# Altium project DRA818V Ham module.PrjPcb
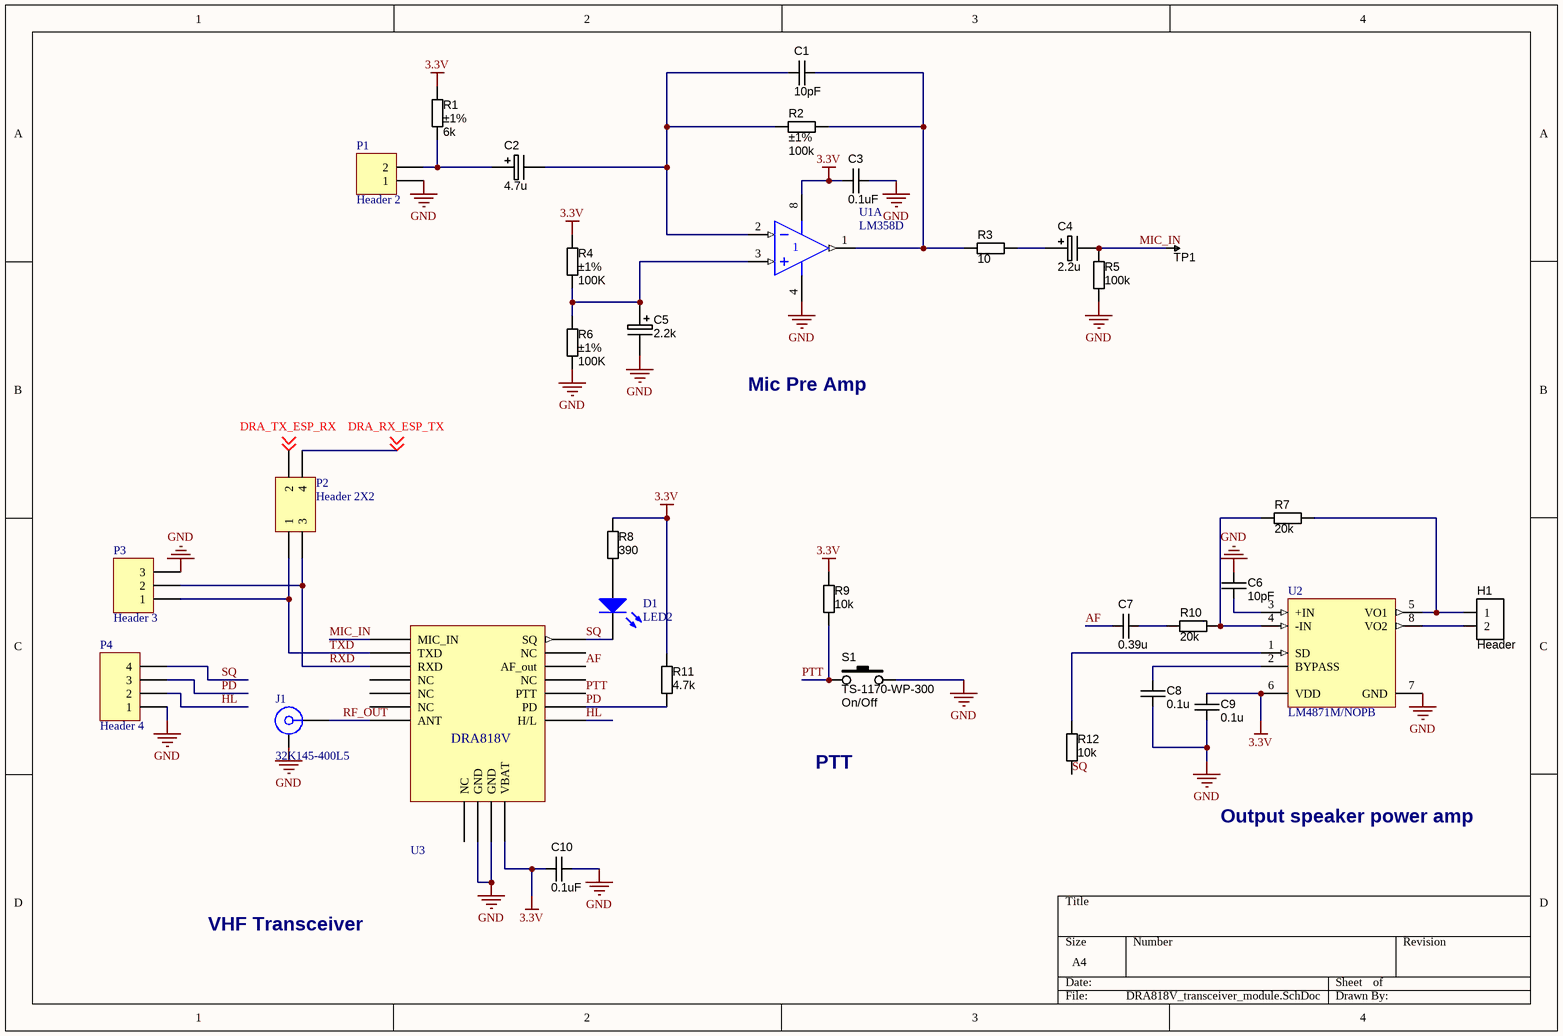
[diagram p0: DRA818V_transceiver_module.SchDoc]
2 sheets, 65 parts. Net scope: global (net labels, ports and power ports of the same name join across sheets).
Board files: DRA818V Ham module.PcbDoc, DRA818_Ham_module_2.PcbDoc
Sheets:
  DRA818V_transceiver_module.SchDoc
  ESP12_interface.SchDoc

## Sheet DRA818V_transceiver_module.SchDoc: DRA818V HAM transceiver
size A4; Date: 4/5/2016; DrawnBy: Salil Tembe; Engineer: Salil Tembe; DocumentNumber: 1; Revision: 1a; SheetNumber: 1; SheetTotal: 1; Reference: https://nebula.wsimg.com/bb20397fc7ffa1e43a58e57264597687?AccessKeyId=DAA432FA80C5DABC0234&disposition=0&alloworigin=1; DocumentName: DRA818V HAM transceiver

### Parts
C1  value 10pF  [CAPC2012X135N]  (hidden comment: approved sub OK)
C2  4.7u  [CAPMP3216X180N]
C3  value 0.1uF  [CAPC2012X135N]  (hidden comment: approved sub OK)
C4  2.2u  [CAPMP3216X180N]
C5  2.2k  [CAPMP3216X180N]
C6  value 10pF  [CAPC2012X135N]  (hidden comment: approved sub OK)
C7  value 0.39u  [CAPC2012X135N]  (hidden comment: approved sub OK)
C8  value 0.1u  [CAPC2012X135N]  (hidden comment: approved sub OK)
C9  value 0.1u  [CAPC2012X135N]  (hidden comment: approved sub OK)
C10  value 0.1uF  [CAPC2012X135N]  (hidden comment: approved sub OK)
D1  LED2  [3.2X1.6X1.1]
H1  Header  [HDR_1x2_Offset]  (no BOM)
J1  32K145-400L5  [ROS-32K145-400L5_V]
P1  Header 2  [HDR1X2]
P2  Header 2X2  [HDR2X2]
P3  Header 3  [HDR1X3]
P4  Header 4  [HDR1X4]
R1  value 6k  Tolerance: ±1%  [ERA-0805]  (hidden comment: Thick Film)
R2  value 100k  Tolerance: ±1%  [ERA-0805]  (hidden comment: Thick Film)
R3  value 10  [ERA-0805]  (hidden comment: Jumper)
R4  value 100K  Tolerance: ±1%  [ERA-0805]  (hidden comment: Thick Film)
R5  value 100k  [6-0805]  (hidden comment: Jumper)
R6  value 100K  Tolerance: ±1%  [ERA-0805]  (hidden comment: Thick Film)
R7  value 20k  [ERA-0805]  (hidden comment: Jumper)
R8  value 390  [ERA-0805]  (hidden comment: Jumper)
R9  value 10k  [ERA-0805]  (hidden comment: Jumper)
R10  value 20k  [ERA-0805]  (hidden comment: Jumper)
R11  value 4.7k  [ERA-0805]  (hidden comment: Jumper)
R12  value 10k  [ERA-0805]  (hidden comment: Jumper)
S1  Manufacturer Part Number 1: TS-1170-WP-300  Function: On/Off  [TACT-SWITCH-TS1170]  (hidden comment: SW_THT_PB_7.0mm)
TP1  TESTPOINT  [TP-R60]  (value not drawn)  (no BOM)
U1  LM358D  [751-02_N]  (part A of 2)
U2  LM4871M/NOPB  [M08A_N]
U3  DRA818V  [DRA818_breakout]  (value not drawn)

### Nets
3.3V: C3.1 C9.2 C10.1 R1.1 R4.1 R8.2 R9.1 R11.1 U1.8(V+) U2.6(VDD) U3.8(VBAT)
GND: C3.2 C5.2 C6.2 C8.1 C9.1 C10.2 J1.MP P1.1 P3.3 P4.1 R5.2 R6.2 S1.2 U1.4(V-) U2.7(GND) U3.9(GND) U3.10(GND)
AF: C7.1 U3.3(AF_out)
DRA_RX_ESP_TX: P2.4 ; off-sheet DRA_RX_ESP_TX
DRA_TX_ESP_RX: P2.2 ; off-sheet DRA_TX_ESP_RX
HL: P4.2 U3.7(H/L)
MIC_IN: C4.2 R5.1 TP1.1 U3.18(MIC_IN)
PD: P4.3 R11.2 U3.6(PD)
PTT: R9.2 S1.1 U3.5(PTT)
RF_OUT: J1.1 U3.12(ANT)
RXD: P2.3 P3.2 U3.16(RXD)
SQ: D1.2(K) P4.4 R12.2 U3.1(SQ)
TXD: P2.1 P3.1 U3.17(TXD)
NetC1_1: C1.1 C2.2 R2.1 U1.2(IN-)
NetC1_2: C1.2 R2.2 R3.1 U1.1(OUT)
NetC2_1: C2.1 P1.2 R1.2
NetC4_1: C4.1 R3.2
NetC5_1: C5.1 R4.2 R6.1 U1.3(IN+)
NetC6_1: C6.1 U2.3(+IN)
NetC7_2: C7.2 R10.1
NetC8_2: C8.2 U2.2(BYPASS)
NetD1_1: D1.1(A) R8.1
NetH1_1: H1.1 R7.2 U2.5(VO1)
NetH1_2: H1.2 U2.8(VO2)
NetR7_1: R7.1 R10.2 U2.4(-IN)
NetR12_1: R12.1 U2.1(SD)

Not connected (* = marked no-connect by the designer): U3 2(NC) 4(NC) 11(NC) 13(NC) 14(NC) 15(NC)

### Notes on the sheet
- Mic Pre Amp
- PTT
- Output speaker power amp
- VHF Transceiver

### Library data of the parts
C1 C3 C6-C10 = CAPC_100n_0805_X7R_100V_10%: Capacitor SMD Cer 100nF 10% 100V X7R 0805; Manufacturer 1: TDK Corporation; Manufacturer Part Number 1: C2012X7R2A104K; Ratings: 100V; X7R; Material: ceramic; SCDType: undef; Package / Case: 0805; Tolerance: ±10%; Supplier 1: Digi-Key; Supplier Part Number 1: 445-1418-1-ND
C2 C4 C5 = CAPT_33u_3216_6V3: Capacitor SMD Tantalum 33uF 10% 6.3V 3216-18; Manufacturer 1: Kemet; Manufacturer Part Number 1: T491A336K006AT; Material: Solid Tantalum; SCDType: source; Package / Case: EIA 535BAAC size A; Ratings: 6.3V; Tolerance: ±10%; ComponentLink2URL: http://www.avx.com/docs/Catalogs/tcj.pdf; ComponentLink2Description: http://www.avx.com/docs/Catalogs/tcj.pdf; Supplier 1: Digi-Key; Supplier Part Number 1: 399-9716-1-ND; ComponentLink1URL: http://capacitoredge.kemet.com/capedge2/DataSheet?pn=T491A336K006AT; ComponentLink1Description: http://capacitoredge.kemet.com/capedge2/DataSheet?pn=T491A336K006AT; Supplier 2: Digi-Key; Supplier Part Number 2: 478-1666-1-ND; Manufacturer 2: AVX Corporation; Manufacturer Part Number 2: TAJA336K006RNJ; Manufacturer 4: Samsung Electro-Mechanics; Manufacturer Part Number 4: TCSCS0J336KAAR; ComponentLink4URL: http://components.arrow.com/partservice/dataview/altium/51540102S9917798N4139?apiKey=aa438727d59eed98c4bed826d8d949c84cb5e685b92bf87346a0226bd2658797; ComponentLink4Description: http://components.arrow.com/partservice/dataview/altium/51540102S9917798N4139?apiKey=aa438727d59eed98c4bed826d8d949c84cb5e685b92bf87346a0226bd2658797; Supplier 3: Digi-Key; Supplier Part Number 3: 293D336X96R3A2TE3-ND; Manufacturer Part Number 3: 293D336X96R3A2TE3; Manufacturer 3: Vishay Sprague; ComponentLink3URL: http://www.vishay.com/doc?40002; ComponentLink3Description: http://www.vishay.com/doc?40002; Supplier 4: Arrow; Supplier Part Number 4: 51540102S9917798N4139
  C2: Value: 4.7u
  C4: Value: 2.2u
  C5: Value: 2.2k
D1 = LED2: Typical RED, GREEN, YELLOW, AMBER GaAs LED; Published: 8-Jun-2000; LatestRevisionDate: 17-Jul-2002; LatestRevisionNote: Re-released for DXP Platform.; PackageVersion: Feb-2002; PackageReference: 3.2X1.6X1.1; Publisher: Altium Limited; PackageDescription: SM LED; 2 Flat Leads
H1 = Header2P: Header, 2-pin
J1 = 32K145-400L5: SMA Right Angle Jack, Edge Mount, Up to 18 GHz, -55 to 155 degC; Design Note 1: Footprint in library is a generic example - only application specific footprint delivers High Performance; Desgin Note 2: For more information about DRC setting, please look at following webpage, http://techdocs.altium.com/display/SCRT/Design+Rule+for+Edge-Mount+Connectors; DatasheetVersion: b00; PackageVersion: b00; PackageReference: 32K145-400L5; PackageDescription: SMA Right Angle Jack, Edge Mount, 14.25 x 9.5 x 4.46 mm; Mounting Technology: Surface Mount; PartNumber: 32K145-400L5; ComponentLink1Description: Manufacturer URL; ComponentLink1URL: http://www.rosenberger.de; ComponentLink2Description: Datasheet; ComponentLink2URL: http://rosenberger.de/ok/images/documents/db/32K145-400L5.pdf; ComponentLink3Description: Package Specification; ComponentLink3URL: http://rosenberger.de/ok/images/documents/db/32K145-400L5.pdf; ComponentLink4Description: Series Overview / Design Note; ComponentLink4URL: http://rosenberger.de/ok/images/documents/spez/32.pdf; ComponentLink5Description: Webshop / RFQ; ComponentLink5URL: http://www.rosenberger.com/en/contact/sales/
P1 = Header 2: Header, 2-Pin; LatestRevisionDate: 17-Jul-2002; LatestRevisionNote: Re-released for DXP Platform.; Publisher: Altium Limited
P2 = Header 2X2: Header, 2-Pin, Dual row; LatestRevisionDate: 17-Jul-2002; LatestRevisionNote: Re-released for DXP Platform.; Publisher: Altium Limited
P3 = Header 3: Header, 3-Pin; LatestRevisionDate: 17-Jul-2002; LatestRevisionNote: Re-released for DXP Platform.; Publisher: Altium Limited
P4 = Header 4: Header, 4-Pin; LatestRevisionDate: 17-Jul-2002; LatestRevisionNote: Re-released for DXP Platform.; Publisher: Altium Limited
R1 = RES_1K3_0805_1%: Resistor SMD chip 1.3k Ohm 0.125W 1% 0805; Manufacturer 1: Vishay/Dale; Manufacturer Part Number 1: CRCW08051K30FKEA; Ratings: 1/8W; SCDType: spec; Package / Case: 0805 (2012 metric); Supplier 1: Digi-Key; Supplier Part Number 1: 541-1.30KCCT-ND
R2 = RES_7K87_0805_1%: Resistor SMD chip 7.87k Ohm 0.125W 1% 0805; Manufacturer 1: Vishay/Dale; Manufacturer Part Number 1: CRCW08057K87FKEA; Ratings: 1/8W; SCDType: spec; Package / Case: 0805 (2012 metric); Supplier 1: Digi-Key; Supplier Part Number 1: 541-7.87KCCT-ND
R3 R5 R7-R12 = RES_0R_0805: Resistor SMD chip 0.0 Ohm 0.125W 0805; Manufacturer 1: Samsung Electro-Mechanics America, Inc; Manufacturer Part Number 1: RC2012J000CS; Ratings: 1/8W; SCDType: spec; Tolerance: N/A; Package / Case: 0805 (2012 metric); Supplier 1: Digi-Key; Supplier Part Number 1: 1276-5466-6-ND; RoHS 1: RoHS Compliant; ComponentLink1URL: http://www.samsungsem.com/servlet/FileDownload?filename=productcatalog/pdf/Chip_Resistor.pdf; ComponentLink1Description: http://www.samsungsem.com/servlet/FileDownload?filename=productcatalog/pdf/Chip_Resistor.pdf; Supplier 2: Digi-Key; Supplier Part Number 2: RMCF0805ZT0R00DKR-ND; Manufacturer 2: Stackpole Electronics Inc; Manufacturer Part Number 2: RMCF0805ZT0R00; RoHS 2: RoHS Compliant; ComponentLink2URL: http://www.seielect.com/Catalog/SEI-RMCF_RMCP.pdf; ComponentLink2Description: http://www.seielect.com/Catalog/SEI-RMCF_RMCP.pdf; Supplier 3: Digi-Key; Supplier Part Number 3: 311-0.0ARDKR-ND; Manufacturer 3: Yageo; Manufacturer Part Number 3: RC0805JR-070RL; RoHS 3: RoHS Compliant; ComponentLink3URL: http://media.digikey.com/pdf/Data%20Sheets/Yageo%20PDFs/RC0805%20Pb%20Free.pdf; ComponentLink3Description: http://media.digikey.com/pdf/Data%20Sheets/Yageo%20PDFs/RC0805%20Pb%20Free.pdf; Supplier 4: Digi-Key; Supplier Part Number 4: P0.0ADKR-ND; Manufacturer 4: Panasonic Electronic Components; Manufacturer Part Number 4: ERJ-6GEY0R00V; RoHS 4: RoHS Compliant; ComponentLink4URL: http://industrial.panasonic.com/www-cgi/jvcr13pz.cgi?E+PZ+3+AOA0001+ERJ6GEY0R00V+7+WW; ComponentLink4Description: http://industrial.panasonic.com/www-cgi/jvcr13pz.cgi?E+PZ+3+AOA0001+ERJ6GEY0R00V+7+WW; Supplier 5: Digi-Key; Supplier Part Number 5: RHM0.0CPDKR-ND; Manufacturer 5: Rohm Semiconductor; Manufacturer Part Number 5: MCR10ERTJ000; RoHS 5: RoHS Compliant; ComponentLink5URL: http://rohmfs.rohm.com/en/products/databook/datasheet/passive/resistor/chip_resistor/mcr_g.pdf; ComponentLink5Description: http://rohmfs.rohm.com/en/products/databook/datasheet/passive/resistor/chip_resistor/mcr_g.pdf
R4 R6 = RES_100K_0805_1%: Resistor SMD chip 100k Ohm 0.125W 1% 0805; Manufacturer 1: Vishay/Dale; Manufacturer Part Number 1: CRCW0805100KFKEA; Ratings: 1/8W; SCDType: spec; Package / Case: 0805 (2012 metric); Supplier 1: Digi-Key; Supplier Part Number 1: 541-100KCCT-ND
S1 = SW_THT_PB_7.0mm: Switch, tact, 7.0mm stem; Manufacturer 1: Bond-Tact; SCDType: source*; Package / Case: 6.5x6.5mm; 7.0mm stem; Material: Brass/Nylon/Ag plating
TP1 = TESTPOINT: SMD test pin
U1 = LM358D: Dual Low-Power Operational Amplifier; Published: 17-Jul-2002; LatestRevisionDate: 13-Apr-2006; LatestRevisionNote: IPC-7351 Footprint Added.; DatasheetVersion: 1988; PackageReference: 751-02; Publisher: Altium Limited; PackageDescription: 8-Pin Small Outline Integrated Circuit 1.27 mm Pitch; Code_JEDEC: MS-012-AA; Code_IPC: SOIC127P600-8; ComponentLink1Description: Manufacturer Link; ComponentLink1URL: http://www.onsemi.com/site/products/parametrics/0,4446,251,00.html; ComponentLink2Description: Datasheet; ComponentLink2URL: http://www.onsemi.com/pub/Collateral/LM358-D.PDF
U2 = LM4871M/NOPB: 3W Audio Power Amplifier with Shutdown Mode, 8-pin Narrow SOIC, Pb-Free; Manufacturer: National Semiconductor; PackageTopMarking: NSZXTT*4871; PowerWise: N; CompType: Audio IC; Published: 1-Mar-2010; DatasheetVersion: Jan-2003; PackageVersion: revM, May-2009; PackageReference: M08A; Publisher: Altium Limited; PackageDescription: SOIC Narrow, 4.9 x 3.9 x 1.45mm, 8 Lead, 1.27mm Pitch; Supplier 1: Digi-Key; Supplier Part Number 1: LM4871M-ND; Supplier 2: Farnell; Supplier Part Number 2: 1468873; PartNumber: LM4871M/NOPB; RoHS: Y; PinCount: 8; Code_JEDEC: MS-012-AA; Code_IPC: SOIC127P600-8; ComponentLink1Description: LM4871 Datasheet; ComponentLink1URL: http://www.national.com/ds/LM/LM4871.pdf; ComponentLink2Description: LM4871 Web Page; ComponentLink2URL: http://www.national.com/pf/LM/LM4871.html; ComponentLink3Description: M08A Package Page; ComponentLink3URL: http://www.national.com/packaging/folders/m08a.html

## Sheet ESP12_interface.SchDoc
size A4
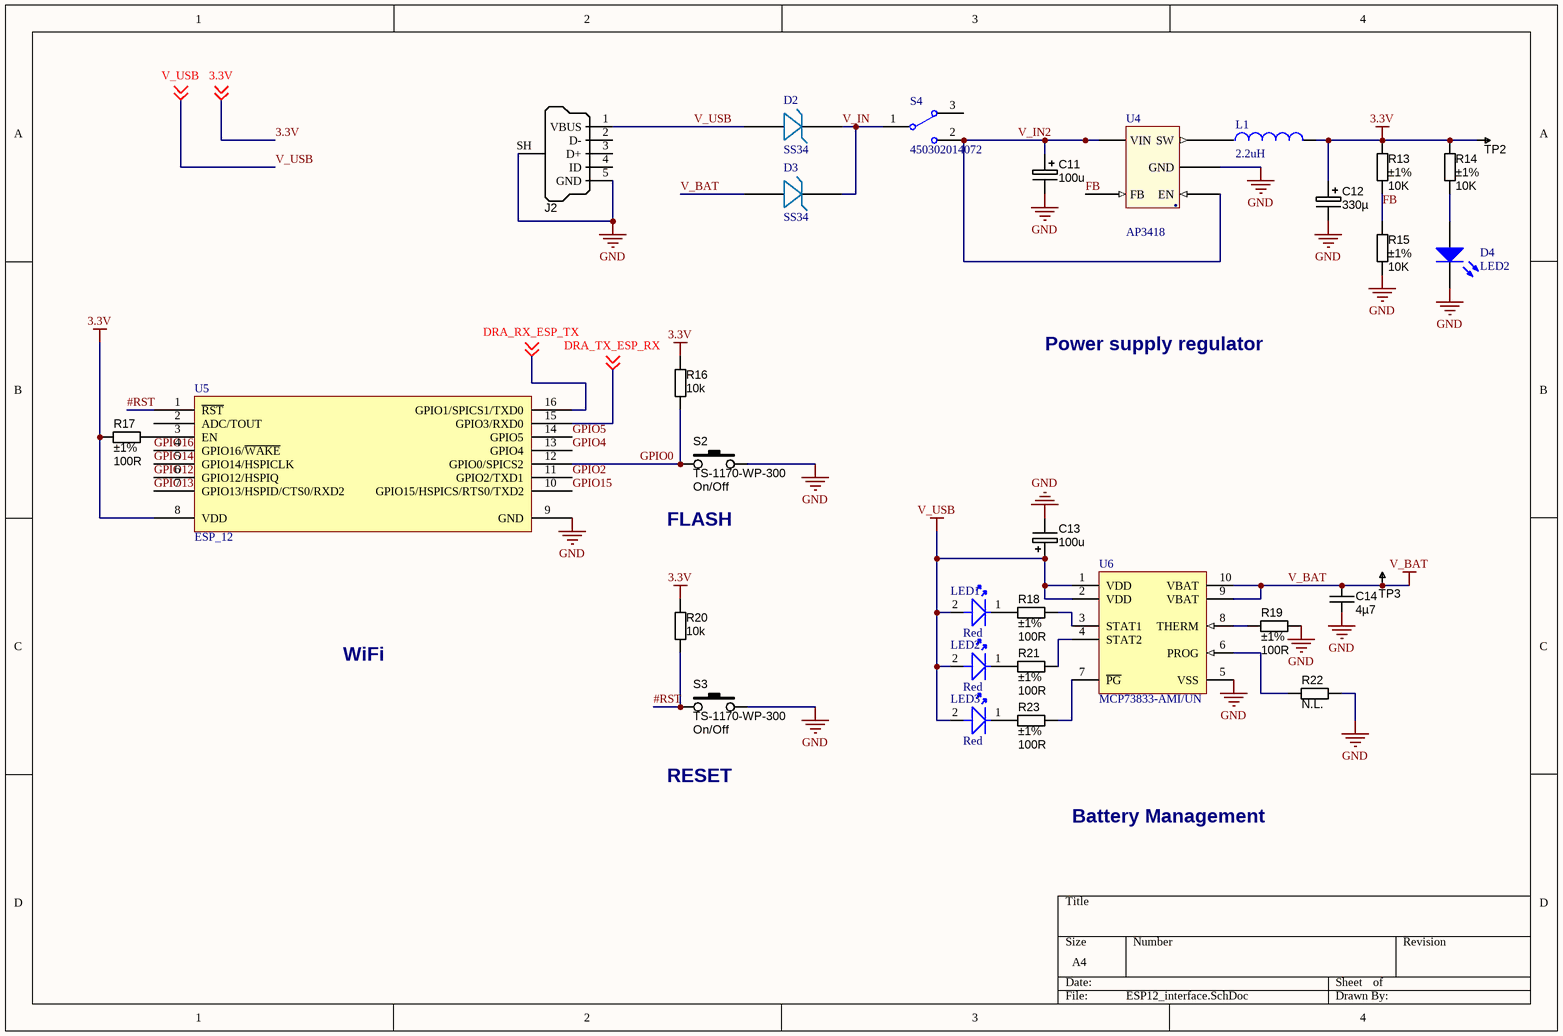
[diagram p1: ESP12_interface.SchDoc]

### Parts
C11  100u  [CAPMP7343X310N]
C12  330µ  [CAPMP7343X310N]
C13  100u  [CAPMP7343X310N]
C14  value 4µ7  [CAPC2012X135N]  (hidden comment: approved sub OK)
D2  SS34  [DO-214AB]
D3  SS34  [DO-214AB]
D4  LED2  [3.2X1.6X1.1]
J2  USB Micro Type B (recommended if hand soldering)  [USB_Micro-B_FCI_SMD]  (value not drawn)
L1  value 2.2uH  [Inductor 6.8uH Shielded]  (hidden comment: SRN6045)
LED1  Red  [Type 3mm]
LED2  Red  [Type 3mm]
LED3  Red  [Type 3mm]
R13  value 10K  Tolerance: ±1%  [RESC2012X70N]  (hidden comment: Thick Film)
R14  value 10K  Tolerance: ±1%  [RESC2012X70N]  (hidden comment: Thick Film)
R15  value 10K  Tolerance: ±1%  [RESC2012X70N]  (hidden comment: Thick Film)
R16  value 10k  [ERA-0805]  (hidden comment: Jumper)
R17  value 100R  Tolerance: ±1%  [RESC2012X70N]  (hidden comment: Thick Film)
R18  value 100R  Tolerance: ±1%  [RESC2012X70N]  (hidden comment: Thick Film)
R19  value 100R  Tolerance: ±1%  [RESC2012X70N]  (hidden comment: Thick Film)
R20  value 10k  [ERA-0805]  (hidden comment: Jumper)
R21  value 100R  Tolerance: ±1%  [RESC2012X70N]  (hidden comment: Thick Film)
R22  value N.L.  [RESC2012X70N]  (hidden comment: RES_NL_0805)  (no BOM)
R23  value 100R  Tolerance: ±1%  [RESC2012X70N]  (hidden comment: Thick Film)
S2  Manufacturer Part Number 1: TS-1170-WP-300  Function: On/Off  [TACT-SWITCH-TS1170]  (hidden comment: SW_THT_PB_7.0mm)
S3  Manufacturer Part Number 1: TS-1170-WP-300  Function: On/Off  [TACT-SWITCH-TS1170]  (hidden comment: SW_THT_PB_7.0mm)
S4  450302014072  [450302014072]
TP2  TESTPOINT  [TP-R60]  (value not drawn)  (no BOM)
TP3  TESTPOINT  [TP-R60]  (value not drawn)  (no BOM)
U4  AP3418  [SOT23-5]
U5  ESP_12  [ESP_12]
U6  MCP73833-AMI/UN  [MSOP-UN10_N]

### Nets
3.3V: C12.1 L1.2 R13.1 R14.1 R16.1 R17.1 R20.1 TP2.1 U5.8(VDD) ; off-sheet 3.3V
GND: C11.2 C12.2 C13.2 C14.2 D4.2(K) J2.5(GND) J2.SH(Shell) R15.2 R19.2 R22.2 S2.2 S3.2 U4.2(GND) U5.9(GND) U6.5(VSS)
V_BAT: C14.1 D3.A TP3.1 U6.9(VBAT) U6.10(VBAT)
V_USB: C13.1 D2.A J2.1(VBUS) LED1.2(A) LED2.2(A) LED3.2(A) U6.1(VDD) U6.2(VDD) ; off-sheet V_USB
#RST: R20.2 S3.1 U5.1(~{RST})
DRA_RX_ESP_TX: U5.16(GPIO1/SPICS1/TXD0) ; off-sheet DRA_RX_ESP_TX
DRA_TX_ESP_RX: U5.15(GPIO3/RXD0) ; off-sheet DRA_TX_ESP_RX
FB: R13.2 R15.1 U4.5(FB)
GPIO0: R16.2 S2.1 U5.12(GPIO0/SPICS2)
GPIO2: U5.11(GPIO2/TXD1)
GPIO4: U5.13(GPIO4)
GPIO5: U5.14(GPIO5)
GPIO12: U5.6(GPIO12/HSPIQ)
GPIO13: U5.7(GPIO13/HSPID/CTS0/RXD2)
GPIO14: U5.5(GPIO14/HSPICLK)
GPIO15: U5.10(GPIO15/HSPICS/RTS0/TXD2)
GPIO16: U5.4(GPIO16/~{WAKE})
V_IN: D2.K D3.K S4.1
V_IN2: C11.1 S4.2 U4.1(EN) U4.4(VIN)
NetD4_1: D4.1(A) R14.2
NetL1_1: L1.1 U4.3(SW)
NetLED1_1: LED1.1(K) R18.1
NetLED2_1: LED2.1(K) R21.1
NetLED3_1: LED3.1(K) R23.1
NetR17_2: R17.2 U5.3(EN)
NetR18_2: R18.2 U6.3(STAT1)
NetR19_1: R19.1 U6.8(THERM)
NetR21_2: R21.2 U6.4(STAT2)
NetR22_1: R22.1 U6.6(PROG)
NetR23_2: R23.2 U6.7(~{PG})

Not connected (* = marked no-connect by the designer): J2 2(D-) 3(D+) 4(ID); S4 3; U5 2(ADC/TOUT)

### Notes on the sheet
- Power supply regulator
- (near S2) FLASH
- WiFi
- RESET
- Battery Management
- (in symbol AP3418) .

### Library data of the parts
C11-C13 = CAPT_330u_2917_6V3: Capacitor SMD Tant 330uF 20% 6V3 2917; Manufacturer Size Code: D; Manufacturer Part Number: T520D337M006ATE015; Ratings: 6.3V; Material: Solid Tantalum; ESR (Equivalent Series Resistance): 15 mOhm; SCDType: spec; Package / Case: 2917 (7343 Metric); Tolerance: ±20%; Operating Temperature: -55°C ~ 125°C; Size / Dimension: 0.287" L x 0.169" W (7.30mm x 4.30mm); Height - Seated (Max): 0.122" (3.10mm); Supplier 1: Digi-Key; Supplier Part Number 1: 399-4052-1-ND; ComponentLink1URL: http://www.kemet.com/datasheets&T520D337M006ATE015; ComponentLink1Description: T520D Datasheet
  C11 C13: Value: 100u
  C12: Value: 330µ
C14 = CAPC_4u7_0805: Capacitor SMD Cer 4.7uF 10% 16V X5R 0805; Manufacturer 1: Taiyo Yuden; Manufacturer Part Number 1: EMK212BJ475KG-T; Ratings: 16V; X5R; Material: ceramic; SCDType: spec; Package / Case: 0805 (2012 Metric); Tolerance: ±10%; Supplier 1: Digi-Key; Supplier Part Number 1: 587-1294-1-ND; Operating Temperature: -55°C ~ 85°C; Size / Dimension: 0.079" L x 0.049" W (2.00mm x 1.25mm); Thickness (Max): 0.053" (1.35mm); ComponentLink1URL: http://www.yuden.co.jp/productdata/catalog/en/mlcc01_e.pdf; ComponentLink1Description: http://www.yuden.co.jp/productdata/catalog/en/mlcc01_e.pdf; Supplier 2: Digi-Key; Supplier Part Number 2: 1276-1065-1-ND; Manufacturer 2: Samsung Electro-Mechanics America, Inc; Manufacturer Part Number 2: CL21A475KOFNNNE; RoHS 2: RoHS Compliant; ComponentLink2URL: http://www.samsungsem.com/servlet/FileDownload?type=spec&file=CL21A475KOFNNNE.pdf; ComponentLink2Description: http://www.samsungsem.com/servlet/FileDownload?type=spec&file=CL21A475KOFNNNE.pdf; Supplier 3: Digi-Key; Supplier Part Number 3: 399-8101-1-ND; Manufacturer 3: Kemet; Manufacturer Part Number 3: C0805C475K4PACTU; RoHS 3: RoHS Compliant; ComponentLink3URL: http://capacitoredge.kemet.com/capedge2/DataSheet?pn=C0805C475K4PACTU; ComponentLink3Description: http://capacitoredge.kemet.com/capedge2/DataSheet?pn=C0805C475K4PACTU; Supplier 4: Digi-Key; Supplier Part Number 4: 490-7215-1-ND; Manufacturer 4: Murata Electronics North America; Manufacturer Part Number 4: GRM21BR61C475MA88L; RoHS 4: RoHS Compliant; ComponentLink4URL: http://psearch.murata.com/capacitor/product/GRM21BR61C475MA88#.pdf; ComponentLink4Description: http://psearch.murata.com/capacitor/product/GRM21BR61C475MA88#.pdf; Supplier 5: Digi-Key; Supplier Part Number 5: 445-7640-1-ND; Manufacturer 5: TDK Corporation; Manufacturer Part Number 5: C2012X5R1C475K125AC; RoHS 5: RoHS Compliant; ComponentLink5URL: http://product.tdk.com/capacitor/mlcc/en/documents/mlcc_commercial_general_en.pdf; ComponentLink5Description: http://product.tdk.com/capacitor/mlcc/en/documents/mlcc_commercial_general_en.pdf; RoHS 1: RoHS Compliant
D2 D3 = SS34 Schotkey Diode
D4 = LED2: as D1 on sheet DRA818V_transceiver_module; Published: 8-Jun-2000; LatestRevisionDate: 17-Jul-2002; LatestRevisionNote: Re-released for DXP Platform.; PackageVersion: Feb-2002; PackageReference: 3.2X1.6X1.1; Publisher: Altium Limited; PackageDescription: SM LED; 2 Flat Leads
J2 = USB_Micro_TypeB_FCI: Connector SMD-THD USB Micro Type B middle mount; Manufacturer 1: FCI; Manufacturer Part Number 1: 10103593-0001LF; SCDType: undef; Package / Case: SMD/THD mid-mount; Supplier 1: Digi-Key; Supplier Part Number 1: 609-4049-1-ND
L1 = Bourns Shielded inductor: SRN6045 shielded inductor
LED1-LED3 = WL-TMRW, Type 3mm, 151031YS06000: THT LED round mono-color color lens, WL-TMRW, Yellow; Manufacturer: Würth Elektronik eiSos GmbH; PartNo: 151031YS06000; ComponentLink1Description: Manufacturer; ComponentLink1URL: http://www.we-online.de; Created by: Christin Otto; Created Date: Oct-2014; ComponentLink2Description: Datasheet; ComponentLink2URL: http://katalog.we-online.de/pbs/datasheet/7448042001.pdfhttp://katalog.we-online.de/pbs/datasheet/7448042001.pdfhttp://katalog.we-online.de/pbs/datasheet/7448042001.pdfhttp://katalog.we-online.de/pbs/datasheet/151031YS06000.pdf; Emitting color: Yellow
R13-R15 = RES_10K_0805_1%: Resistor SMD chip 10k Ohm 0.125W 1% 0805; Manufacturer 1: Vishay/Dale; Manufacturer Part Number 1: CRCW080510K0FKEA; Ratings: 1/8W; SCDType: spec; Package / Case: 0805 (2012 metric); Supplier 1: Digi-Key; Supplier Part Number 1: 541-10.0KCCT-ND; Material: Thick Film
R16 R20 = RES_0R_0805: as R3 on sheet DRA818V_transceiver_module; Tolerance: N/A; Package / Case: 0805 (2012 metric); Supplier 1: Digi-Key; Supplier Part Number 1: 1276-5466-6-ND; RoHS 1: RoHS Compliant; ComponentLink1URL: http://www.samsungsem.com/servlet/FileDownload?filename=productcatalog/pdf/Chip_Resistor.pdf; ComponentLink1Description: http://www.samsungsem.com/servlet/FileDownload?filename=productcatalog/pdf/Chip_Resistor.pdf; Supplier 2: Digi-Key; Supplier Part Number 2: RMCF0805ZT0R00DKR-ND; Manufacturer 2: Stackpole Electronics Inc; Manufacturer Part Number 2: RMCF0805ZT0R00; RoHS 2: RoHS Compliant; ComponentLink2URL: http://www.seielect.com/Catalog/SEI-RMCF_RMCP.pdf; ComponentLink2Description: http://www.seielect.com/Catalog/SEI-RMCF_RMCP.pdf; Supplier 3: Digi-Key; Supplier Part Number 3: 311-0.0ARDKR-ND; Manufacturer 3: Yageo; Manufacturer Part Number 3: RC0805JR-070RL; RoHS 3: RoHS Compliant; ComponentLink3URL: http://media.digikey.com/pdf/Data%20Sheets/Yageo%20PDFs/RC0805%20Pb%20Free.pdf; ComponentLink3Description: http://media.digikey.com/pdf/Data%20Sheets/Yageo%20PDFs/RC0805%20Pb%20Free.pdf; Supplier 4: Digi-Key; Supplier Part Number 4: P0.0ADKR-ND; Manufacturer 4: Panasonic Electronic Components; Manufacturer Part Number 4: ERJ-6GEY0R00V; RoHS 4: RoHS Compliant; ComponentLink4URL: http://industrial.panasonic.com/www-cgi/jvcr13pz.cgi?E+PZ+3+AOA0001+ERJ6GEY0R00V+7+WW; ComponentLink4Description: http://industrial.panasonic.com/www-cgi/jvcr13pz.cgi?E+PZ+3+AOA0001+ERJ6GEY0R00V+7+WW; Supplier 5: Digi-Key; Supplier Part Number 5: RHM0.0CPDKR-ND; Manufacturer 5: Rohm Semiconductor; Manufacturer Part Number 5: MCR10ERTJ000; RoHS 5: RoHS Compliant; ComponentLink5URL: http://rohmfs.rohm.com/en/products/databook/datasheet/passive/resistor/chip_resistor/mcr_g.pdf; ComponentLink5Description: http://rohmfs.rohm.com/en/products/databook/datasheet/passive/resistor/chip_resistor/mcr_g.pdf
R17-R19 R21 R23 = RES_100R_0805_1%: Resistor SMD chip 100 Ohm 0.125W 1% 0805; Manufacturer 1: Yageo; Manufacturer Part Number 1: RC0805FR-07100RL; Ratings: 1/8 W; SCDType: spec; Package / Case: 0805 (2012 Metric); Material: Thick Film; Supplier 1: Digi-Key; Supplier Part Number 1: 311-100CRCT-ND
R22 = RES_NL_0805: Resistor, SMD chip; Package / Case: 0805 (2012 metric)
S2 S3 = SW_THT_PB_7.0mm: as S1 on sheet DRA818V_transceiver_module; Package / Case: 6.5x6.5mm; 7.0mm stem; Material: Brass/Nylon/Ag plating
S4 = WS-SLTU, 450302014072: WS-SLTU 10x2.5 mm THT right angled; Manufacturer: Wurth Elektronik; partNo: 450302014072; ComponentLink1Description: Manufacturer; ComponentLink1URL: http://www.we-online.de; Created by: Baojun Chen; Created Date: Dec.2015; ComponentLink2Description: Datasheet; ComponentLink2URL: http://katalog.we-online.de/em/datasheet/450302014072.pdf
TP2 TP3 = TESTPOINT: SMD test pin
U4 = AP3418: DC/DC buck converter
U5 = ESP_12: ESP-12 Wi-Fi Module by AI-Thinker; IC: ESP8266-EX; Vendor: Ai-thinker
U6 = MCP73833-AMI/UN: Stand-Alone Linear Li-Ion/Li-Polymer Charge Management Controller with Power-Good Output, 4.2V, 10-Pin MSOP, Industrial Temperature; Published: 29-Jan-2009; LatestRevisionDate: 27-Nov-2009; LatestRevisionNote: Updated to datasheet revision B, May-2009; DatasheetVersion: revB, May-2009; PackageVersion: revBB, Aug-2009; PackageReference: MSOP-UN10; Publisher: Altium Limited; PackageDescription: 10-Lead Plastic Micro Small Outline Package (UN) [MSOP]; Supplier 1: Digi-Key; Supplier Part Number 1: MCP73833-AMI/UN-ND; Supplier 2: Farnell; Supplier Part Number 2: 1332160; ComponentLink1Description: Datasheet; ComponentLink1URL: http://ww1.microchip.com/downloads/en/DeviceDoc/22005b.pdf; ComponentLink2Description: Packaging Specification; ComponentLink2URL: http://www.microchip.com/stellent/groups/techpub_sg/documents/packagingspec/en012702.pdf; ComponentLink3Description: Microchip.com Home; ComponentLink3URL: http://www.microchip.com/

## Nets that join several sheets
3.3V: DRA818V_transceiver_module (11 pins), ESP12_interface (9 pins)
GND: DRA818V_transceiver_module (17 pins), ESP12_interface (15 pins)
DRA_RX_ESP_TX: DRA818V_transceiver_module (P2.4), ESP12_interface (U5.16)
DRA_TX_ESP_RX: DRA818V_transceiver_module (P2.2), ESP12_interface (U5.15)